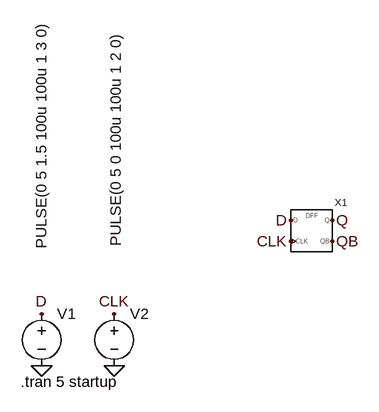
[diagram p0: schematic DFFTest.asc]
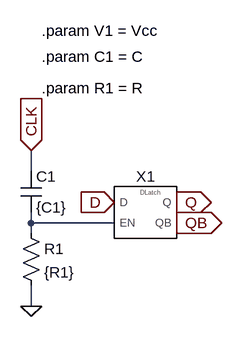
[diagram p1: sub-circuit dff.asc]
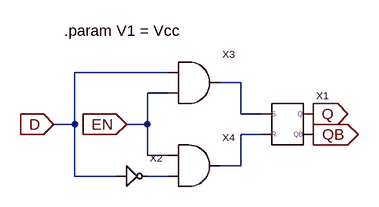
[diagram p2: sub-circuit dlatch.asc]
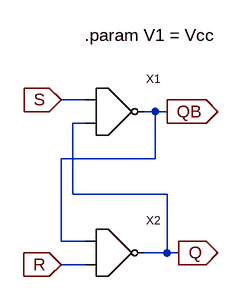
[diagram p3: sub-circuit srlatch.asc]
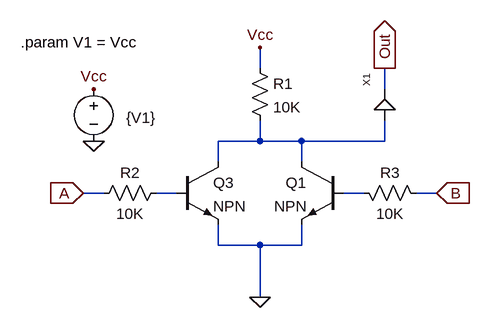
[diagram p4: sub-circuit nor.asc]
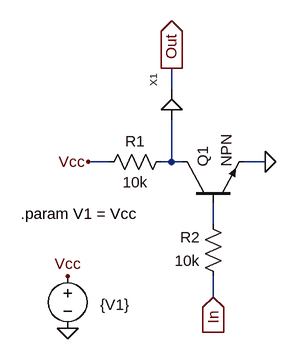
[diagram p5: sub-circuit not.asc]
DFFTest.asc, the LTspice schematic file:
Version 4
SHEET 1 880 680
FLAG -112 240 0
FLAG -224 240 0
FLAG -224 160 D
FLAG -112 160 CLK
FLAG 224 16 Q
FLAG 224 48 QB
FLAG 160 16 D
FLAG 160 48 CLK
SYMBOL voltage -224 144 R0
WINDOW 3 0 -435 VRight 2
WINDOW 123 0 0 Left 0
WINDOW 39 0 0 Left 0
SYMATTR Value PULSE(0 5 1.5 100u 100u 1 3 0)
SYMATTR InstName V1
SYMBOL voltage -112 144 R0
WINDOW 3 2 -418 VRight 2
WINDOW 123 0 0 Left 0
WINDOW 39 0 0 Left 0
SYMATTR Value PULSE(0 5 0 100u 100u 1 2 0)
SYMATTR InstName V2
SYMBOL DFF 208 16 R0
SYMATTR InstName X1
TEXT -256 264 Left 2 !.tran 5 startup

dff.asc, the sub-circuit schematic file:
Version 4
SHEET 1 880 680
WIRE 0 96 0 64
WIRE 0 176 0 160
WIRE 128 176 0 176
WIRE 0 192 0 176
WIRE 0 304 0 272
FLAG 0 304 0
FLAG 0 64 CLK
IOPIN 0 64 In
FLAG 224 144 Q
IOPIN 224 144 Out
FLAG 224 176 QB
IOPIN 224 176 Out
FLAG 128 144 D
IOPIN 128 144 In
SYMBOL cap -16 96 R0
SYMATTR InstName C1
SYMATTR Value {C1}
SYMBOL res -16 176 R0
SYMATTR InstName R1
SYMATTR Value {R1}
SYMBOL DLatch 176 160 R0
SYMATTR InstName X1
SYMATTR SpiceLine Vcc = V1
TEXT 16 -80 Left 2 !.param C1 = C
TEXT 16 -32 Left 2 !.param R1 = R
TEXT 16 -120 Left 2 !.param V1 = Vcc

dlatch.asc, the sub-circuit schematic file:
Version 4
SHEET 1 880 680
WIRE -64 -16 -208 -16
WIRE 48 0 16 0
WIRE -64 16 -96 16
WIRE 48 48 48 0
WIRE 80 48 48 48
WIRE -208 64 -208 -16
WIRE -208 64 -240 64
WIRE -96 64 -96 16
WIRE -96 64 -128 64
WIRE 80 80 48 80
WIRE -96 112 -96 64
WIRE -64 112 -96 112
WIRE 48 128 48 80
WIRE 48 128 16 128
WIRE -208 144 -208 64
WIRE -144 144 -208 144
WIRE -64 144 -96 144
FLAG -128 64 EN
IOPIN -128 64 In
FLAG -240 64 D
IOPIN -240 64 In
FLAG 160 48 Q
IOPIN 160 48 Out
FLAG 160 80 QB
IOPIN 160 80 Out
SYMBOL SRLatch 112 48 R0
SYMATTR InstName X1
SYMATTR SpiceLine Vcc = {V1}
SYMBOL AND -48 0 R0
SYMATTR InstName X3
SYMATTR SpiceLine Vcc = {V1}
SYMBOL AND -48 128 R0
SYMATTR InstName X4
SYMATTR SpiceLine Vcc = {V1}
SYMBOL NOT -144 144 R0
SYMATTR InstName X2
SYMATTR SpiceLine Vcc = {V1}
TEXT -224 -80 Left 2 !.param V1 = Vcc

srlatch.asc, the sub-circuit schematic file:
Version 4
SHEET 1 968 680
WIRE 144 128 112 128
WIRE 240 144 224 144
WIRE 256 144 240 144
WIRE 144 160 128 160
WIRE 240 208 240 144
WIRE 240 208 112 208
WIRE 128 256 128 160
WIRE 256 256 128 256
WIRE 112 320 112 208
WIRE 144 320 112 320
WIRE 256 336 256 256
WIRE 256 336 224 336
WIRE 272 336 256 336
WIRE 144 352 112 352
FLAG 112 128 S
IOPIN 112 128 In
FLAG 112 352 R
IOPIN 112 352 In
FLAG 272 336 Q
IOPIN 272 336 Out
FLAG 256 144 QB
IOPIN 256 144 Out
SYMBOL NOR 144 144 R0
SYMATTR InstName X1
SYMATTR SpiceLine Vcc = V1
SYMBOL NOR 144 336 R0
SYMATTR InstName X2
SYMATTR SpiceLine Vcc = V1
TEXT 144 40 Left 2 !.param V1 = Vcc

nor.asc, the sub-circuit schematic file:
Version 4
SHEET 1 880 680
WIRE 240 -80 240 -112
WIRE 432 -48 432 -80
WIRE 240 32 240 0
WIRE 240 32 176 32
WIRE 304 32 240 32
WIRE 432 32 432 0
WIRE 432 32 304 32
WIRE 176 64 176 32
WIRE 304 64 304 32
WIRE 0 112 -32 112
WIRE 112 112 80 112
WIRE 400 112 368 112
WIRE 512 112 480 112
WIRE 176 192 176 160
WIRE 240 192 176 192
WIRE 304 192 304 160
WIRE 304 192 240 192
WIRE 240 272 240 192
FLAG -32 112 A
IOPIN -32 112 In
FLAG 512 112 B
IOPIN 512 112 In
FLAG 432 -80 Out
IOPIN 432 -80 Out
FLAG 240 -112 Vcc
FLAG 240 272 0
FLAG -16 32 0
FLAG -16 -48 Vcc
SYMBOL res 224 -96 R0
SYMATTR InstName R1
SYMATTR Value 10K
SYMATTR SpiceLine tol=1 pwr=0.1
SYMBOL res 96 96 R90
WINDOW 0 0 56 VBottom 2
WINDOW 3 32 56 VTop 2
SYMATTR InstName R2
SYMATTR Value 10K
SYMATTR SpiceLine tol=1 pwr=0.1
SYMBOL res 384 96 M90
WINDOW 0 0 56 VBottom 2
WINDOW 3 32 56 VTop 2
SYMATTR InstName R3
SYMATTR Value 10K
SYMATTR SpiceLine tol=1 pwr=0.1
SYMBOL Buffer 432 0 R270
SYMATTR InstName X1
SYMBOL npn 112 64 R0
SYMATTR InstName Q3
SYMBOL npn 368 64 M0
SYMATTR InstName Q1
SYMBOL voltage -16 -64 R0
WINDOW 0 24 16 Invisible 2
WINDOW 3 50 60 Left 2
SYMATTR InstName V1
SYMATTR Value {V1}
TEXT -128 -120 Left 2 !.param V1 = Vcc

not.asc, the sub-circuit schematic file:
Version 4
SHEET 1 880 680
WIRE 112 16 112 -16
WIRE 16 128 -16 128
WIRE 112 128 112 64
WIRE 112 128 96 128
WIRE 128 128 112 128
WIRE 256 128 224 128
WIRE 176 224 176 192
WIRE 176 336 176 304
FLAG 176 336 In
IOPIN 176 336 In
FLAG 112 -16 Out
IOPIN 112 -16 Out
FLAG -48 384 0
FLAG -48 304 Vcc
FLAG -16 128 Vcc
FLAG 256 128 0
SYMBOL npn 128 192 R270
SYMATTR InstName Q1
SYMBOL res 112 112 R90
WINDOW 0 0 56 VBottom 2
WINDOW 3 32 56 VTop 2
SYMATTR InstName R1
SYMATTR Value 10k
SYMBOL res 192 320 R180
WINDOW 0 36 76 Left 2
WINDOW 3 36 40 Left 2
SYMATTR InstName R2
SYMATTR Value 10k
SYMBOL Buffer 112 64 R270
SYMATTR InstName X1
SYMBOL voltage -48 288 R0
WINDOW 0 24 16 Invisible 2
WINDOW 3 50 60 Left 2
SYMATTR InstName V1
SYMATTR Value {V1}
TEXT -120 208 Left 2 !.param V1 = Vcc

The netlist it stands for:
* DFFTest.asc
V1 D 0 PULSE(0 5 1.5 100u 100u 1 3 0)
V2 CLK 0 PULSE(0 5 0 100u 100u 1 2 0)
XX1 D CLK Q QB dff params: Vcc = 5V, C = 0.1u, R = 1k

* block symbol definitions
.subckt dff D CLK Q QB
C1 CLK N001 {C1}
R1 N001 0 {R1}
XX1 D N001 Q QB dlatch params: Vcc = V1
.param C1 = C
.param R1 = R
.param V1 = Vcc
.ends dff

.subckt dlatch D EN Q QB
XX1 Q QB N001 N002 srlatch params: Vcc = {V1}
XX3 D EN N001 AND Vcc = {V1}  ; pins A B Out
XX4 EN N003 N002 AND Vcc = {V1}  ; pins A B Out
XX2 N003 D not params: Vcc = {V1}
.param V1 = Vcc
.ends dlatch

.subckt srlatch Q QB S R
XX1 S Q QB nor params: Vcc = V1
XX2 QB R Q nor params: Vcc = V1
.param V1 = Vcc
.ends srlatch

.subckt nor A B Out
R1 Vcc N001 10K tol=1 pwr=0.1
R2 N002 A 10K tol=1 pwr=0.1
R3 N003 B 10K tol=1 pwr=0.1
XX1 N001 Out Buffer Vcc = 5V  ; pins In Out
Q3 N001 N002 0 0 NPN
Q1 N001 N003 0 0 NPN
V1 Vcc 0 {V1}
.param V1 = Vcc
.ends nor

.subckt not Out In
Q1 N001 N002 0 0 NPN
R1 N001 Vcc 10k
R2 In N002 10k
XX1 N001 Out Buffer Vcc = 5V  ; pins In Out
V1 Vcc 0 {V1}
.param V1 = Vcc
.ends not

.model NPN NPN
.model PNP PNP
.lib standard.bjt
.tran 5 startup
.backanno
.end